# Altium schematic sheet MCU.SchDoc
size A
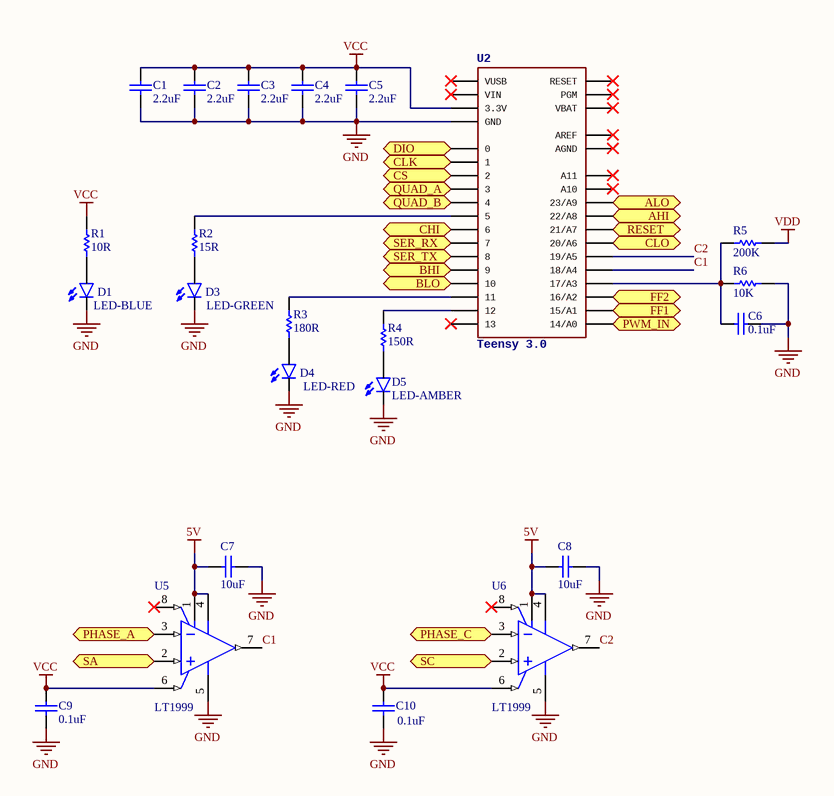
[diagram p0: MCU.SchDoc]

## Parts
C1  2.2uF  [CAPC0603(1608)55_N]
C2  2.2uF  [CAPC0603(1608)55_N]
C3  2.2uF  [CAPC0603(1608)55_N]
C4  2.2uF  [CAPC0603(1608)55_N]
C5  2.2uF  [CAPC0603(1608)55_N]
C6  0.1uF  [CAPC0603(1608)100_L]
C7  10uF  [CAPC0603(1608)100_M]
C8  10uF  [CAPC0603(1608)100_N]
C9  0.1uF  [CAPC0603(1608)100_L]
C10  0.1uF  [CAPC0603(1608)100_L]
D1  LED-BLUE  [LED-1206]
D3  LED-GREEN  [LED-1206]
D4  LED-RED  [LED-1206]
D5  LED-AMBER  [LED-1206]
R1  10R  [RESC0603(1608)_N]
R2  15R  [RESC0603(1608)_N]
R3  180R  [RESC0603(1608)_N]
R4  150R  [RESC0603(1608)_N]
R5  200K  [RESC0603(1608)_N]
R6  10K  [RESC0603(1608)_N]
U2  Teensy 3.0  [TEENSY_3.0+4]
U5  LT1999  [LT-MS8-8_N]
U6  LT1999  [LT-MS8-8_N]

## Ports
AHI (out), ALO (out), BHI (out), BLO (out), CHI (out), CLK (out), CLO (out), CS (out), DIO (in), FF1 (in), FF2 (in), PHASE_A (in), PHASE_C (in), PWM_IN (in), QUAD_A (in), QUAD_B (in), RESET (out), SA (in), SC (in), SER_RX (in), SER_TX (in)

## Nets
5V: C7.1 C8.1 U5.1(V+) U5.4(V+) U6.1(V+) U6.4(V+)
GND: C1.1 C2.1 C3.1 C4.1 C5.1 C6.2 C7.2 C8.2 C9.1 C10.1 D1.C D3.C D4.C D5.C R6.2 U2.GND_GND1(GND) U5.5(GND) U6.5(GND)
VCC: C1.2 C2.2 C3.2 C4.2 C5.2 C9.2 C10.2 R1.2 U2.3.3V_3.3V1(3.3V) U5.6(REF) U6.6(REF)
VDD: R5.2
AHI: U2.22/A8 ; port AHI
ALO: U2.23/A9 ; port ALO
BHI: U2.9 ; port BHI
BLO: U2.10 ; port BLO
C1: U2.18/A4 U5.7(OUT)
C2: U2.19/A5 U6.7(OUT)
CHI: U2.6 ; port CHI
CLK: U2.1 ; port CLK
CLO: U2.20/A6 ; port CLO
CS: U2.2 ; port CS
DIO: U2.0 ; port DIO
FF1: U2.15/A1 ; port FF1
FF2: U2.16/A2 ; port FF2
PHASE_A: U5.3(-IN) ; port PHASE_A
PHASE_C: U6.3(-IN) ; port PHASE_C
PWM_IN: U2.14/A0 ; port PWM_IN
QUAD_A: U2.3 ; port QUAD_A
QUAD_B: U2.4 ; port QUAD_B
RESET: U2.21/A7 ; port RESET
SA: U5.2(+IN) ; port SA
SC: U6.2(+IN) ; port SC
SER_RX: U2.7 ; port SER_RX
SER_TX: U2.8 ; port SER_TX
NetC6_1: C6.1 R5.1 R6.1 U2.17/A3
NetD1_A: D1.A R1.1
NetD3_A: D3.A R2.1
NetD4_A: D4.A R3.1
NetD5_A: D5.A R4.1
NetR2_2: R2.2 U2.5
NetR3_2: R3.2 U2.11
NetR4_2: R4.2 U2.12

Not connected (* = marked no-connect by the designer): U2 13* A10* A11* AGND* AREF* PGM* RESET* VBAT* VIN* VUSB*; U5 8(~{SHDN})*; U6 8(~{SHDN})*

## Library data of the parts
C1-C5 = CMP-1035-02762-1: CAP 2.2uF 16V Â±10% 0603 (1608 Metric) Thickness 0.55mm SMD; Case-EIA: 0603; Case-Metric: 1608; Max Thickness: 0.55 mm; Technology: SMT; Value: 2.2uF; Rated Voltage: 16 V; Tolerance: Â±10%
C6 = CMP-1035-02591-1: CAP 100nF 50V Â±5% 0603 (1608 Metric) Thickness 1mm SMD; Case-Metric: 1608; Case-EIA: 0603; Rated Voltage: 50 V; Max Thickness: 1 mm; Tolerance: Â±5%; Technology: SMT; Value: 100nF
C7 = CMP-1035-02796-1: CAP 10uF 6.3V Â±10% 0603 (1608 Metric) Thickness 1mm SMD; Case-EIA: 0603; Case-Metric: 1608; Tolerance: Â±10%; Value: 10uF; Technology: SMT; Rated Voltage: 6.3 V; Max Thickness: 1 mm
C8 = CMP-1035-02797-1: CAP 10uF 6.3V Â±20% 0603 (1608 Metric) Thickness 1mm SMD; Case-Metric: 1608; Case-EIA: 0603; Value: 10uF; Technology: SMT; Tolerance: Â±20%; Max Thickness: 1 mm; Rated Voltage: 6.3 V
C9 C10 = CMP-1035-02577-1: CAP 100nF 6.3V Â±20% 0603 (1608 Metric) Thickness 1mm SMD; Case-EIA: 0603; Case-Metric: 1608; Technology: SMT; Rated Voltage: 6.3 V; Value: 100nF; Max Thickness: 1 mm; Tolerance: Â±20%
D1 = LED-BLUE1206: PROD_ID: DIO-09911
D3 = LED-GREEN1206: PROD_ID: DIO-00862
D4 = LED-RED1206: PROD_ID: DIO-09912
D5 = LED-AMBER1206
R1 = CMP-1012-00026-1: 10R 0.1W 5% 0603 (1608 Metric)  SMD; Case-Metric: 1608; Case-EIA: 0603; Value: 10.00 Ohm; Technology: SMT; Tolerance: 5 %; Power: 0.1 W
R2 = CMP-1012-00030-1: 15R 0.1W 5% 0603 (1608 Metric)  SMD; Case-EIA: 0603; Case-Metric: 1608; Value: 15.00 Ohm; Tolerance: 5 %; Technology: SMT; Power: 0.1 W
R3 = CMP-1012-00056-1: 180R 0.1W 5% 0603 (1608 Metric)  SMD; Value: 180.00 Ohm; Case-EIA: 0603; Case-Metric: 1608; Power: 0.1 W; Technology: SMT; Tolerance: 5 %
R4 = CMP-1012-00054-1: 150R 0.1W 5% 0603 (1608 Metric)  SMD; Case-EIA: 0603; Value: 150.00 Ohm; Case-Metric: 1608; Power: 0.1 W; Tolerance: 5 %; Technology: SMT
R5 = CMP-1012-00129-1: 200K 0.1W 5% 0603 (1608 Metric)  SMD; Case-EIA: 0603; Value: 200000.00 Ohm; Case-Metric: 1608; Technology: SMT; Power: 0.1 W; Tolerance: 5 %
R6 = CMP-1012-00098-1: 10K 0.1W 5% 0603 (1608 Metric)  SMD; Case-EIA: 0603; Value: 10000.00 Ohm; Case-Metric: 1608; Technology: SMT; Tolerance: 5 %; Power: 0.1 W
U2 = TEENSY_3.0+4: pin to pad: 3.3V 3.3V1>3.3V+3.3V1 GND GND1>GND+GND1
U5 U6 = CMP-0359-00619-2: Single Channel, High Voltage, Bidirectional Current Sense Amplifier, 2 MHz Typical GBW, 3 V/us Typical SR, 4.5 to 5.5 V, 8-Pin SOP (MS8-8), High Temperature / Automotive, Pb-Free, Reel; Manufacturer: Linear Technology; PartNumber: LT1999HMS8-20#TRPBF; Linear Technology Part Number: LT1999-20; Is (mA) Typical: 1.55; SR (V/us) Typical: 3; Channels (#): 1; Vs Max (V): 5.5; GBW (MHz) Typical: 2; Vs Min (V): 4.5; Vos (mV) Typical: 0.5; ComponentLink2Description: Datasheet; DatasheetVersion: Rev. B; PackageVersion: Rev G; ComponentLink3Description: Package Specification; ComponentLink2URL: http://cds.linear.com/docs/en/datasheet/1999fb.pdf; PackageReference: LT-MS8-8; PackageDescription: 8-Lead Plastic Small Outline, Body 3.9 x 4.9 mm, Pitch 1.27 mm; RevisionNote: URLs updated; Type: CSA; RoHS: Pb-Free; ComponentLink1URL: http://www.linear.com/; Packing: Reel; ComponentLink3URL: http://cds.linear.com/docs/en/packaging/05081610_G_SO8.pdf; ComponentLink1Description: Manufacturer URL; Mounting Technology: Surface Mount